# Altium schematic sheet CATS-FAT-Pyro.SchDoc: CATS Pro
size A4; Author: Luca Jost; Revision: 1.0; SheetNumber: 5; SheetTotal: 13; Subtitle: High Current Channel
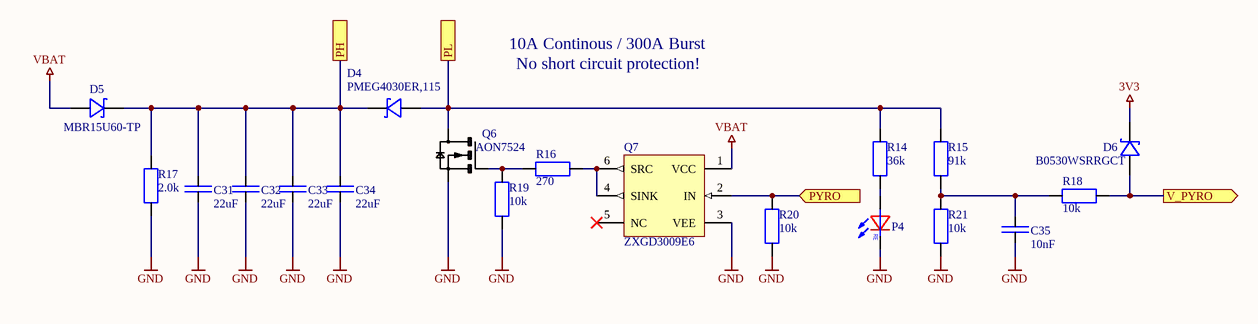
[diagram p0: CATS-FAT-Pyro.SchDoc]

## Parts
C31  22uF  [SMD Keramikkondensator 0805]
C32  22uF  [SMD Keramikkondensator 0805]
C33  22uF  [SMD Keramikkondensator 0805]
C34  22uF  [SMD Keramikkondensator 0805]
C35  10nF  [SMD Keramikkondensator 0603]
D4  PMEG4030ER,115  [SMD Diode SOD-123]
D5  MBR15U60-TP  [SMD Diode TO-277]
D6  B0530WSRRGCT  [SMD Diode SOD-323F]
P4  LED  [SMD LED 0603]  (value not drawn)
Q6  AON7524  [SMD MOSFET DFN 3x3 EP]
Q7  ZXGD3009E6  [SMD IC SOT-23-6]
R14  36k  [SMD Widerstand 0603]
R15  91k  [SMD Widerstand 0603]
R16  270  [SMD Widerstand 0603]
R17  2.0k  [SMD Widerstand 0603]
R18  10k  [SMD Widerstand 0603]
R19  10k  [SMD Widerstand 0603]
R20  10k  [SMD Widerstand 0603]
R21  10k  [SMD Widerstand 0603]

## Ports
PH, PL, PYRO (in), V_PYRO (out)

## Nets
3V3: D6.K
GND: C31.1 C32.1 C33.1 C34.1 C35.1 P4.K Q6.S Q7.3(VEE) R17.1 R19.1 R20.1 R21.1
VBAT: D5.A Q7.1(VCC)
PH: C31.2 C32.2 C33.2 C34.2 D4.K D5.K R17.2 ; port PH
PL: D4.A Q6.D R14.2 R15.2 ; port PL
PYRO: Q7.2(IN) R20.2 ; port PYRO
V_PYRO: D6.A R18.1 ; port V_PYRO
NetC35_2: C35.2 R15.1 R18.2 R21.2
NetP4_A: P4.A R14.1
NetQ6_G: Q6.G R16.1 R19.2
NetQ7_4: Q7.4(SINK) Q7.6(SRC) R16.2

Not connected (* = marked no-connect by the designer): Q7 5(NC)*

## Notes on the sheet
- 10A Continous / 300A Burst
- No short circuit protection!
- Title
- Author:
- Subtitle
- Date:
- Rev:
- CATS
- Sheet
- of
- File:
- (in symbol LED) RE

## Library data of the parts
C31-C34 = E6 - 22uF: SMD Ceramic Capacitor E6; Unit Price: 0.01; Number: -; Supplier: -
C35 = E6 - 10nF: SMD Ceramic Capacitor E6; Unit Price: 0.01; Number: -; Supplier: -
D4 = PMEG4030ER,115: Diode Schottky 3A Surface Mount CFP3; Digikey: 1727-5313-2-ND
D5 = MBR15U60-TP: Diode Schottky 15A Surface Mount TO-277-3; ComponentLink1Description: Datasheet; ComponentLink1URL: https://www.mccsemi.com/pdf/Products/MBR15U60(TO-277).pdf; Digikey: MBR15U60-TPMSTR-ND
D6 = B0530WSRRGCT: 200mW, 0.47V Schottky Barrier Diode; Digikey: B0530WSRRGCT-ND; ComponentLink1Description: Datasheet; ComponentLink1URL: https://www.taiwansemi.com/products/datasheet/B0530WS_J1709.pdf
P4 = LED: Color LED
Q6 = AON7524: N-Channel 30V 25A (Ta), 28A (Tc) 3.1W (Ta), 32W (Tc) Surface Mount 8-DFN (3x3); Item Description: N-Channel MOSFET; Digikey: 785-1634-1-ND; ComponentLink1Description: Datasheet; ComponentLink1URL: http://aosmd.com/res/data_sheets/AON7524.pdf
Q7 = ZXGD3009E6: Low-Side Gate Driver IC Non-Inverting SOT-26; Digikey: ZXGD3009E6TADICT-ND; ComponentLink1Description: Datasheet; ComponentLink1URL: https://www.diodes.com/assets/Datasheets/ZXGD3009E6.pdf
R14 = E24 - 36k: SMD Chip Resistor E24; Unit Price: 0.01; Number: -; Supplier: -
R15 = E24 - 91k: SMD Chip Resistor E24; Unit Price: 0.01; Number: -; Supplier: -
R16 = E24 - 270: SMD Chip Resistor E24; Unit Price: 0.01; Number: -; Supplier: -
R17 = E24 - 2.0k: SMD Chip Resistor E24; Unit Price: 0.01; Number: -; Supplier: -
R18-R21 = E24 - 10k: SMD Chip Resistor E24; Unit Price: 0.01; Number: -; Supplier: -